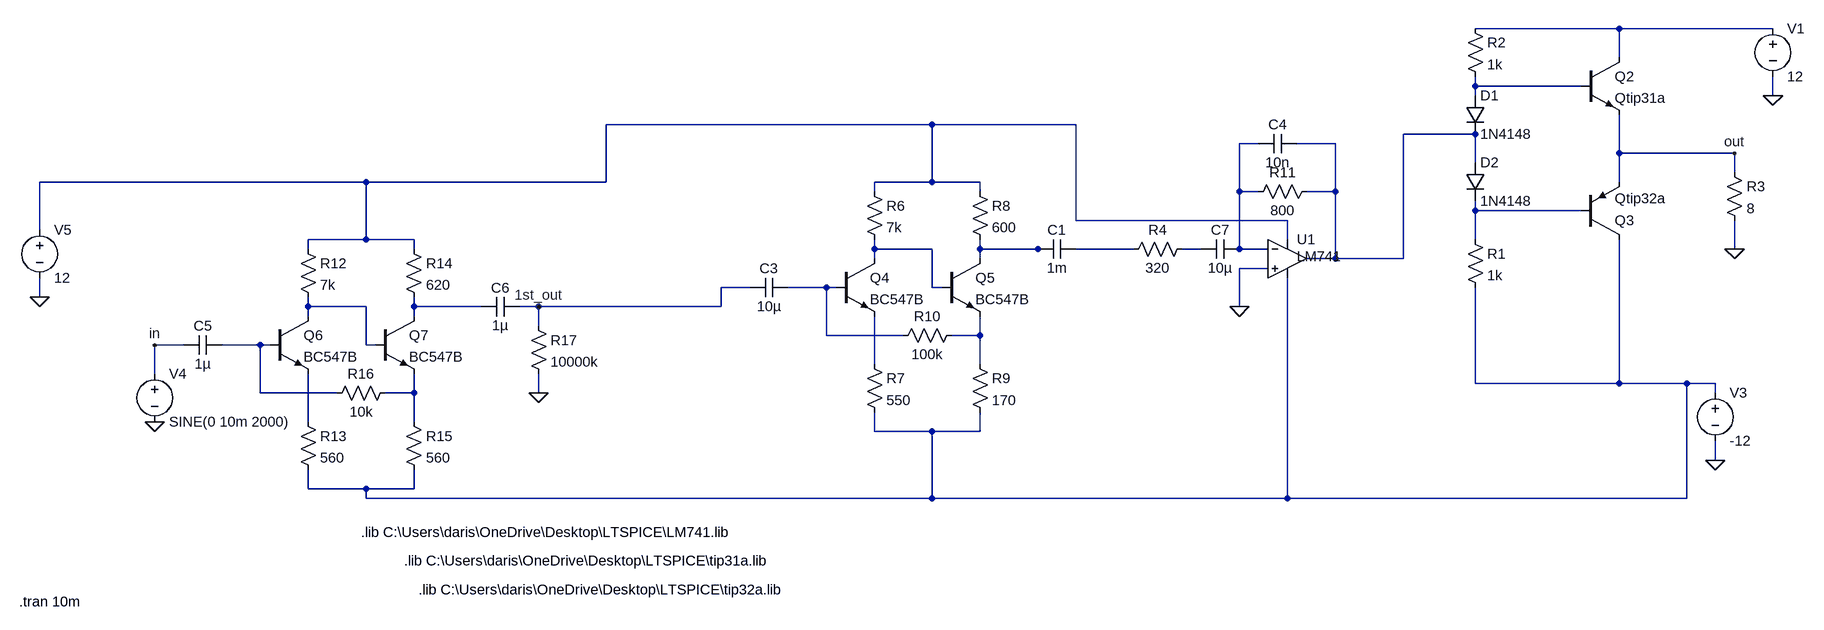
[diagram p0: schematic power_amplifier(3stages) (2).asc]
power_amplifier(3stages) (2).asc, the LTspice schematic file:
Version 4
SHEET 1 3384 844
WIRE 2464 -128 2224 -128
WIRE 2720 -128 2464 -128
WIRE 2464 -80 2464 -128
WIRE 2224 -32 2224 -48
WIRE 2400 -32 2224 -32
WIRE 2224 -16 2224 -32
WIRE 2720 -16 2720 -48
WIRE 640 32 96 32
WIRE 880 32 640 32
WIRE 2224 48 1744 48
WIRE 1184 64 1152 64
WIRE 1312 64 1248 64
WIRE 2464 80 2464 16
WIRE 2656 80 2464 80
WIRE 2224 96 2224 48
WIRE 2656 112 2656 80
WIRE -304 128 -848 128
WIRE 96 128 96 32
WIRE 96 128 -304 128
WIRE 640 128 640 32
WIRE 640 128 544 128
WIRE 720 128 640 128
WIRE 2464 128 2464 80
WIRE 544 144 544 128
WIRE 720 144 720 128
WIRE 1152 144 1152 64
WIRE 1184 144 1152 144
WIRE 1312 144 1312 64
WIRE 1312 144 1264 144
WIRE 2224 176 2224 160
WIRE 2400 176 2224 176
WIRE 880 192 880 32
WIRE 1232 192 880 192
WIRE -848 208 -848 128
WIRE -304 224 -304 128
WIRE -304 224 -400 224
WIRE -224 224 -304 224
WIRE 1232 224 1232 192
WIRE 2224 224 2224 176
WIRE -400 240 -400 224
WIRE -224 240 -224 224
WIRE 544 240 544 224
WIRE 640 240 544 240
WIRE 720 240 720 224
WIRE 816 240 720 240
WIRE 832 240 816 240
WIRE 976 240 880 240
WIRE 1088 240 1056 240
WIRE 1152 240 1152 144
WIRE 1200 240 1152 240
WIRE 2656 240 2656 192
WIRE 544 256 544 240
WIRE 720 256 720 240
WIRE 1312 256 1312 144
WIRE 1312 256 1264 256
WIRE 1744 256 1744 48
WIRE 1744 256 1312 256
WIRE 1200 272 1152 272
WIRE 336 304 288 304
WIRE 464 304 400 304
WIRE 480 304 464 304
WIRE 640 304 640 240
WIRE 656 304 640 304
WIRE -848 320 -848 288
WIRE -400 336 -400 320
WIRE -304 336 -400 336
WIRE -224 336 -224 320
WIRE -112 336 -224 336
WIRE -16 336 -48 336
WIRE 288 336 288 304
WIRE 288 336 -16 336
WIRE 1152 336 1152 272
WIRE -400 352 -400 336
WIRE -224 352 -224 336
WIRE -16 368 -16 336
WIRE 464 384 464 304
WIRE 592 384 464 384
WIRE 720 384 720 352
WIRE 720 384 672 384
WIRE -608 400 -656 400
WIRE -480 400 -544 400
WIRE -464 400 -480 400
WIRE -304 400 -304 336
WIRE -288 400 -304 400
WIRE 544 432 544 352
WIRE 720 432 720 384
WIRE -656 448 -656 400
WIRE 2224 464 2224 304
WIRE 2464 464 2464 224
WIRE 2464 464 2224 464
WIRE 2576 464 2464 464
WIRE 2624 464 2576 464
WIRE -480 480 -480 400
WIRE -352 480 -480 480
WIRE -224 480 -224 448
WIRE -224 480 -272 480
WIRE -16 480 -16 448
WIRE 2624 480 2624 464
WIRE -400 528 -400 448
WIRE -224 528 -224 480
WIRE 544 544 544 512
WIRE 640 544 544 544
WIRE 720 544 720 512
WIRE 720 544 640 544
WIRE 2624 592 2624 560
WIRE -400 640 -400 608
WIRE -304 640 -400 640
WIRE -224 640 -224 608
WIRE -224 640 -304 640
WIRE -304 656 -304 640
WIRE 640 656 640 544
WIRE 640 656 -304 656
WIRE 1232 656 1232 288
WIRE 1232 656 640 656
WIRE 2576 656 2576 464
WIRE 2576 656 1232 656
FLAG 2720 -16 0
FLAG 2624 592 0
FLAG -656 528 0
FLAG -16 480 0
FLAG -656 400 in
FLAG -848 320 0
FLAG -16 336 1st_out
FLAG 2656 240 0
FLAG 1152 336 0
FLAG 2656 80 out
SYMBOL res 2208 -144 R0
SYMATTR InstName R2
SYMATTR Value 1k
SYMBOL diode 2208 -16 R0
SYMATTR InstName D1
SYMATTR Value 1N4148
SYMBOL diode 2208 96 R0
SYMATTR InstName D2
SYMATTR Value 1N4148
SYMBOL npn 2400 -80 R0
SYMATTR InstName Q2
SYMATTR Value Qtip31a
SYMBOL pnp 2400 224 M180
SYMATTR InstName Q3
SYMATTR Value Qtip32a
SYMBOL voltage 2720 -144 R0
WINDOW 123 0 0 Left 0
WINDOW 39 0 0 Left 0
SYMATTR InstName V1
SYMATTR Value 12
SYMBOL voltage 2624 464 R0
SYMATTR InstName V3
SYMATTR Value -12
SYMBOL res 528 128 R0
SYMATTR InstName R6
SYMATTR Value 7k
SYMBOL res 528 416 R0
SYMATTR InstName R7
SYMATTR Value 550
SYMBOL res 704 128 R0
SYMATTR InstName R8
SYMATTR Value 600
SYMBOL res 704 416 R0
SYMATTR InstName R9
SYMATTR Value 170
SYMBOL res 688 368 R90
WINDOW 0 0 56 VBottom 2
WINDOW 3 32 56 VTop 2
SYMATTR InstName R10
SYMATTR Value 100k
SYMBOL cap 400 288 R90
WINDOW 0 0 32 VBottom 2
WINDOW 3 32 32 VTop 2
SYMATTR InstName C3
SYMATTR Value 10µ
SYMBOL npn 480 256 R0
SYMATTR InstName Q4
SYMATTR Value BC547B
SYMBOL npn 656 256 R0
SYMATTR InstName Q5
SYMATTR Value BC547B
SYMBOL res -416 224 R0
SYMATTR InstName R12
SYMATTR Value 7k
SYMBOL res -416 512 R0
SYMATTR InstName R13
SYMATTR Value 560
SYMBOL res -240 224 R0
SYMATTR InstName R14
SYMATTR Value 620
SYMBOL res -240 512 R0
SYMATTR InstName R15
SYMATTR Value 560
SYMBOL res -256 464 R90
WINDOW 0 0 56 VBottom 2
WINDOW 3 32 56 VTop 2
SYMATTR InstName R16
SYMATTR Value 10k
SYMBOL cap -544 384 R90
WINDOW 0 0 32 VBottom 2
WINDOW 3 32 32 VTop 2
SYMATTR InstName C5
SYMATTR Value 1µ
SYMBOL cap -48 320 R90
WINDOW 0 0 32 VBottom 2
WINDOW 3 32 32 VTop 2
SYMATTR InstName C6
SYMATTR Value 1µ
SYMBOL npn -464 352 R0
SYMATTR InstName Q6
SYMATTR Value BC547B
SYMBOL npn -288 352 R0
SYMATTR InstName Q7
SYMATTR Value BC547B
SYMBOL voltage -656 432 R0
WINDOW 123 24 124 Left 2
WINDOW 39 0 0 Left 0
SYMATTR InstName V4
SYMATTR Value SINE(0 10m 2000)
SYMBOL res -32 352 R0
SYMATTR InstName R17
SYMATTR Value 10000k
SYMBOL voltage -848 192 R0
WINDOW 123 0 0 Left 0
WINDOW 39 0 0 Left 0
SYMATTR InstName V5
SYMATTR Value 12
SYMBOL cap 880 224 R90
WINDOW 0 0 32 VBottom 2
WINDOW 3 32 32 VTop 2
SYMATTR InstName C1
SYMATTR Value 1m
SYMBOL OpAmps\\opamp2 1232 192 R0
WINDOW 3 16 60 Left 2
SYMATTR Value LM741
SYMATTR InstName U1
SYMBOL res 2208 208 R0
SYMATTR InstName R1
SYMATTR Value 1k
SYMBOL res 2640 96 R0
SYMATTR InstName R3
SYMATTR Value 8
SYMBOL res 1280 128 R90
WINDOW 0 0 56 VBottom 2
WINDOW 3 32 56 VTop 2
SYMATTR InstName R11
SYMATTR Value 800
SYMBOL cap 1248 48 R90
WINDOW 0 0 32 VBottom 2
WINDOW 3 32 32 VTop 2
SYMATTR InstName C4
SYMATTR Value 10n
SYMBOL res 1072 224 R90
WINDOW 0 0 56 VBottom 2
WINDOW 3 32 56 VTop 2
SYMATTR InstName R4
SYMATTR Value 320
SYMBOL cap 1152 224 R90
WINDOW 0 0 32 VBottom 2
WINDOW 3 32 32 VTop 2
SYMATTR InstName C7
SYMATTR Value 10µ
TEXT -312 712 Left 2 !.lib C:\\Users\\daris\\OneDrive\\Desktop\\LTSPICE\\LM741.lib
TEXT -240 760 Left 2 !.lib C:\\Users\\daris\\OneDrive\\Desktop\\LTSPICE\\tip31a.lib
TEXT -216 808 Left 2 !.lib C:\\Users\\daris\\OneDrive\\Desktop\\LTSPICE\\tip32a.lib
TEXT -882 828 Left 2 !.tran 10m

The netlist it stands for:
* power_amplifier(3stages) (2).asc
R2 N001 N002 1k
D1 N002 N004 1N4148
D2 N004 N006 1N4148
Q2 N001 N002 out 0 Qtip31a
Q3 N017 N006 out 0 Qtip32a
V1 N001 0 12
V3 N017 0 -12
R6 N003 N007 7k
R7 N016 N017 550
R8 N003 N008 600
R9 N014 N017 170
R10 N014 N011 100k
C3 N011 1st_out 10µ
Q4 N007 N011 N016 0 BC547B
Q5 N008 N007 N014 0 BC547B
R12 N003 N012 7k
R13 N019 N017 560
R14 N003 N013 620
R15 N018 N017 560
R16 N018 N015 10k
C5 N015 in 1µ
C6 1st_out N013 1µ
Q6 N012 N015 N019 0 BC547B
Q7 N013 N012 N018 0 BC547B
V4 in 0 SINE(0 10m 2000)
R17 1st_out 0 10000k
V5 N003 0 12
C1 N009 N008 1m
XU1 0 N005 N003 N017 N004 LM741  ; pins In+ In- V+ V- OUT
R1 N006 N017 1k
R3 out 0 8
R11 N004 N005 800
C4 N004 N005 10n
R4 N010 N009 320
C7 N005 N010 10µ
.model D D
.lib standard.dio
.model NPN NPN
.model PNP PNP
.lib standard.bjt
.lib C:\Users\daris\OneDrive\Desktop\LTSPICE\LM741.lib
.lib C:\Users\daris\OneDrive\Desktop\LTSPICE\tip31a.lib
.lib C:\Users\daris\OneDrive\Desktop\LTSPICE\tip32a.lib
.tran 10m
.backanno
.end